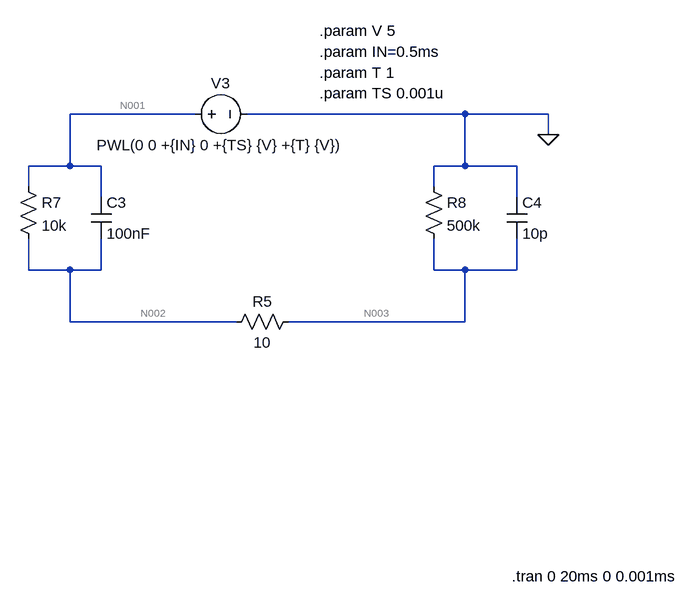
[diagram p0: schematic 電圧刺激等価回路overshooting最小構成.asc]
電圧刺激等価回路overshooting最小構成.asc, the LTspice schematic file:
Version 4
SHEET 1 1088 680
WIRE 320 -368 128 -368
WIRE 736 -368 400 -368
WIRE 864 -368 736 -368
WIRE 864 -336 864 -368
WIRE 128 -288 128 -368
WIRE 128 -288 64 -288
WIRE 176 -288 128 -288
WIRE 736 -288 736 -368
WIRE 736 -288 688 -288
WIRE 816 -288 736 -288
WIRE 64 -256 64 -288
WIRE 688 -256 688 -288
WIRE 176 -240 176 -288
WIRE 816 -240 816 -288
WIRE 64 -128 64 -176
WIRE 128 -128 64 -128
WIRE 176 -128 176 -176
WIRE 176 -128 128 -128
WIRE 688 -128 688 -176
WIRE 736 -128 688 -128
WIRE 816 -128 816 -176
WIRE 816 -128 736 -128
WIRE 128 -48 128 -128
WIRE 384 -48 128 -48
WIRE 736 -48 736 -128
WIRE 736 -48 464 -48
FLAG 864 -336 0
SYMBOL voltage 304 -368 R270
WINDOW 0 32 56 VTop 2
WINDOW 3 -32 56 VBottom 2
WINDOW 123 0 0 Left 0
WINDOW 39 0 0 Left 0
SYMATTR InstName V3
SYMATTR Value PWL(0 0 +{IN} 0 +{TS} {V} +{T} {V})
SYMBOL res 480 -64 R90
WINDOW 0 0 56 VBottom 2
WINDOW 3 32 56 VTop 2
SYMATTR InstName R5
SYMATTR Value 10
SYMBOL cap 160 -240 R0
SYMATTR InstName C3
SYMATTR Value 100nF
SYMBOL cap 800 -240 R0
SYMATTR InstName C4
SYMATTR Value 10p
SYMBOL res 48 -272 R0
SYMATTR InstName R7
SYMATTR Value 10k
SYMBOL res 672 -272 R0
SYMATTR InstName R8
SYMATTR Value 500k
TEXT 512 -496 Left 2 !.param V 5
TEXT 512 -464 Left 2 !.param IN=0.5ms
TEXT 512 -432 Left 2 !.param T 1
TEXT 808 344 Left 2 !.tran 0 20ms 0 0.001ms
TEXT 512 -400 Left 2 !.param TS 0.001u

The netlist it stands for:
* 電圧刺激等価回路overshooting最小構成.asc
V3 N001 0 PWL(0 0 +{IN} 0 +{TS} {V} +{T} {V})
R5 N003 N002 10
C3 N001 N002 100nF
C4 0 N003 10p
R7 N001 N002 10k
R8 0 N003 500k
.param V 5
.param IN=0.5ms
.param T 1
.tran 0 20ms 0 0.001ms
.param TS 0.001u
.backanno
.end

* Results of the author's LTspice run, read from the files saved beside the schematic
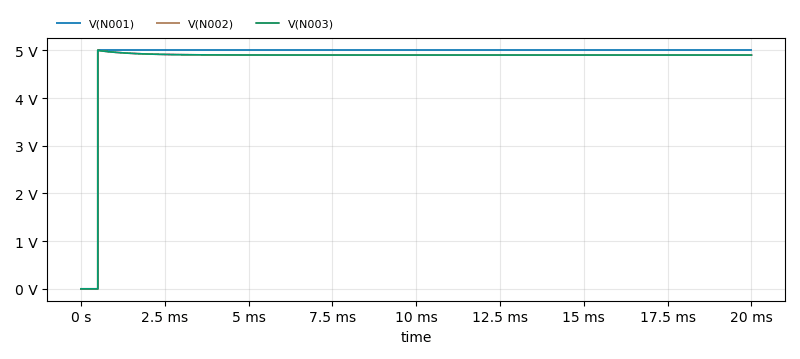
[diagram p1: Transient Analysis of 電圧刺激等価回路overshooting最小構成.asc, plotted from the saved traces]
* Transient Analysis, 1 run:
*   V(N001): min 0 V, max 5 V, average 4.875 V, rms 4.937 V, last 5 V
*   V(N002): min 0 V, max 5 V, average 4.784 V, rms 4.845 V, last 4.902 V
*   V(N003): min 0 V, max 4.999 V, average 4.784 V, rms 4.845 V, last 4.902 V